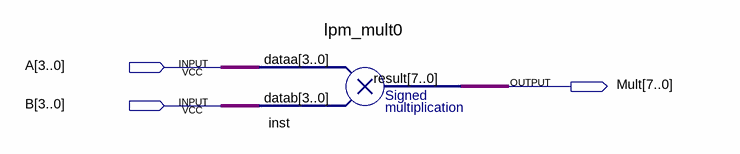
[diagram p0: schematic sheet]
// Quartus schematic lab_8_2.bdf as structural Verilog: 1 symbols, 3 pins
module lab_8_2 (
  input  [3:0] A,
  input  [3:0] B,
  output [7:0] Mult
);

  lpm_mult0 inst (.dataa(A), .datab(B), .result(Mult));
endmodule
